# Altium project SR.PrjPcb (part 2 of 2)
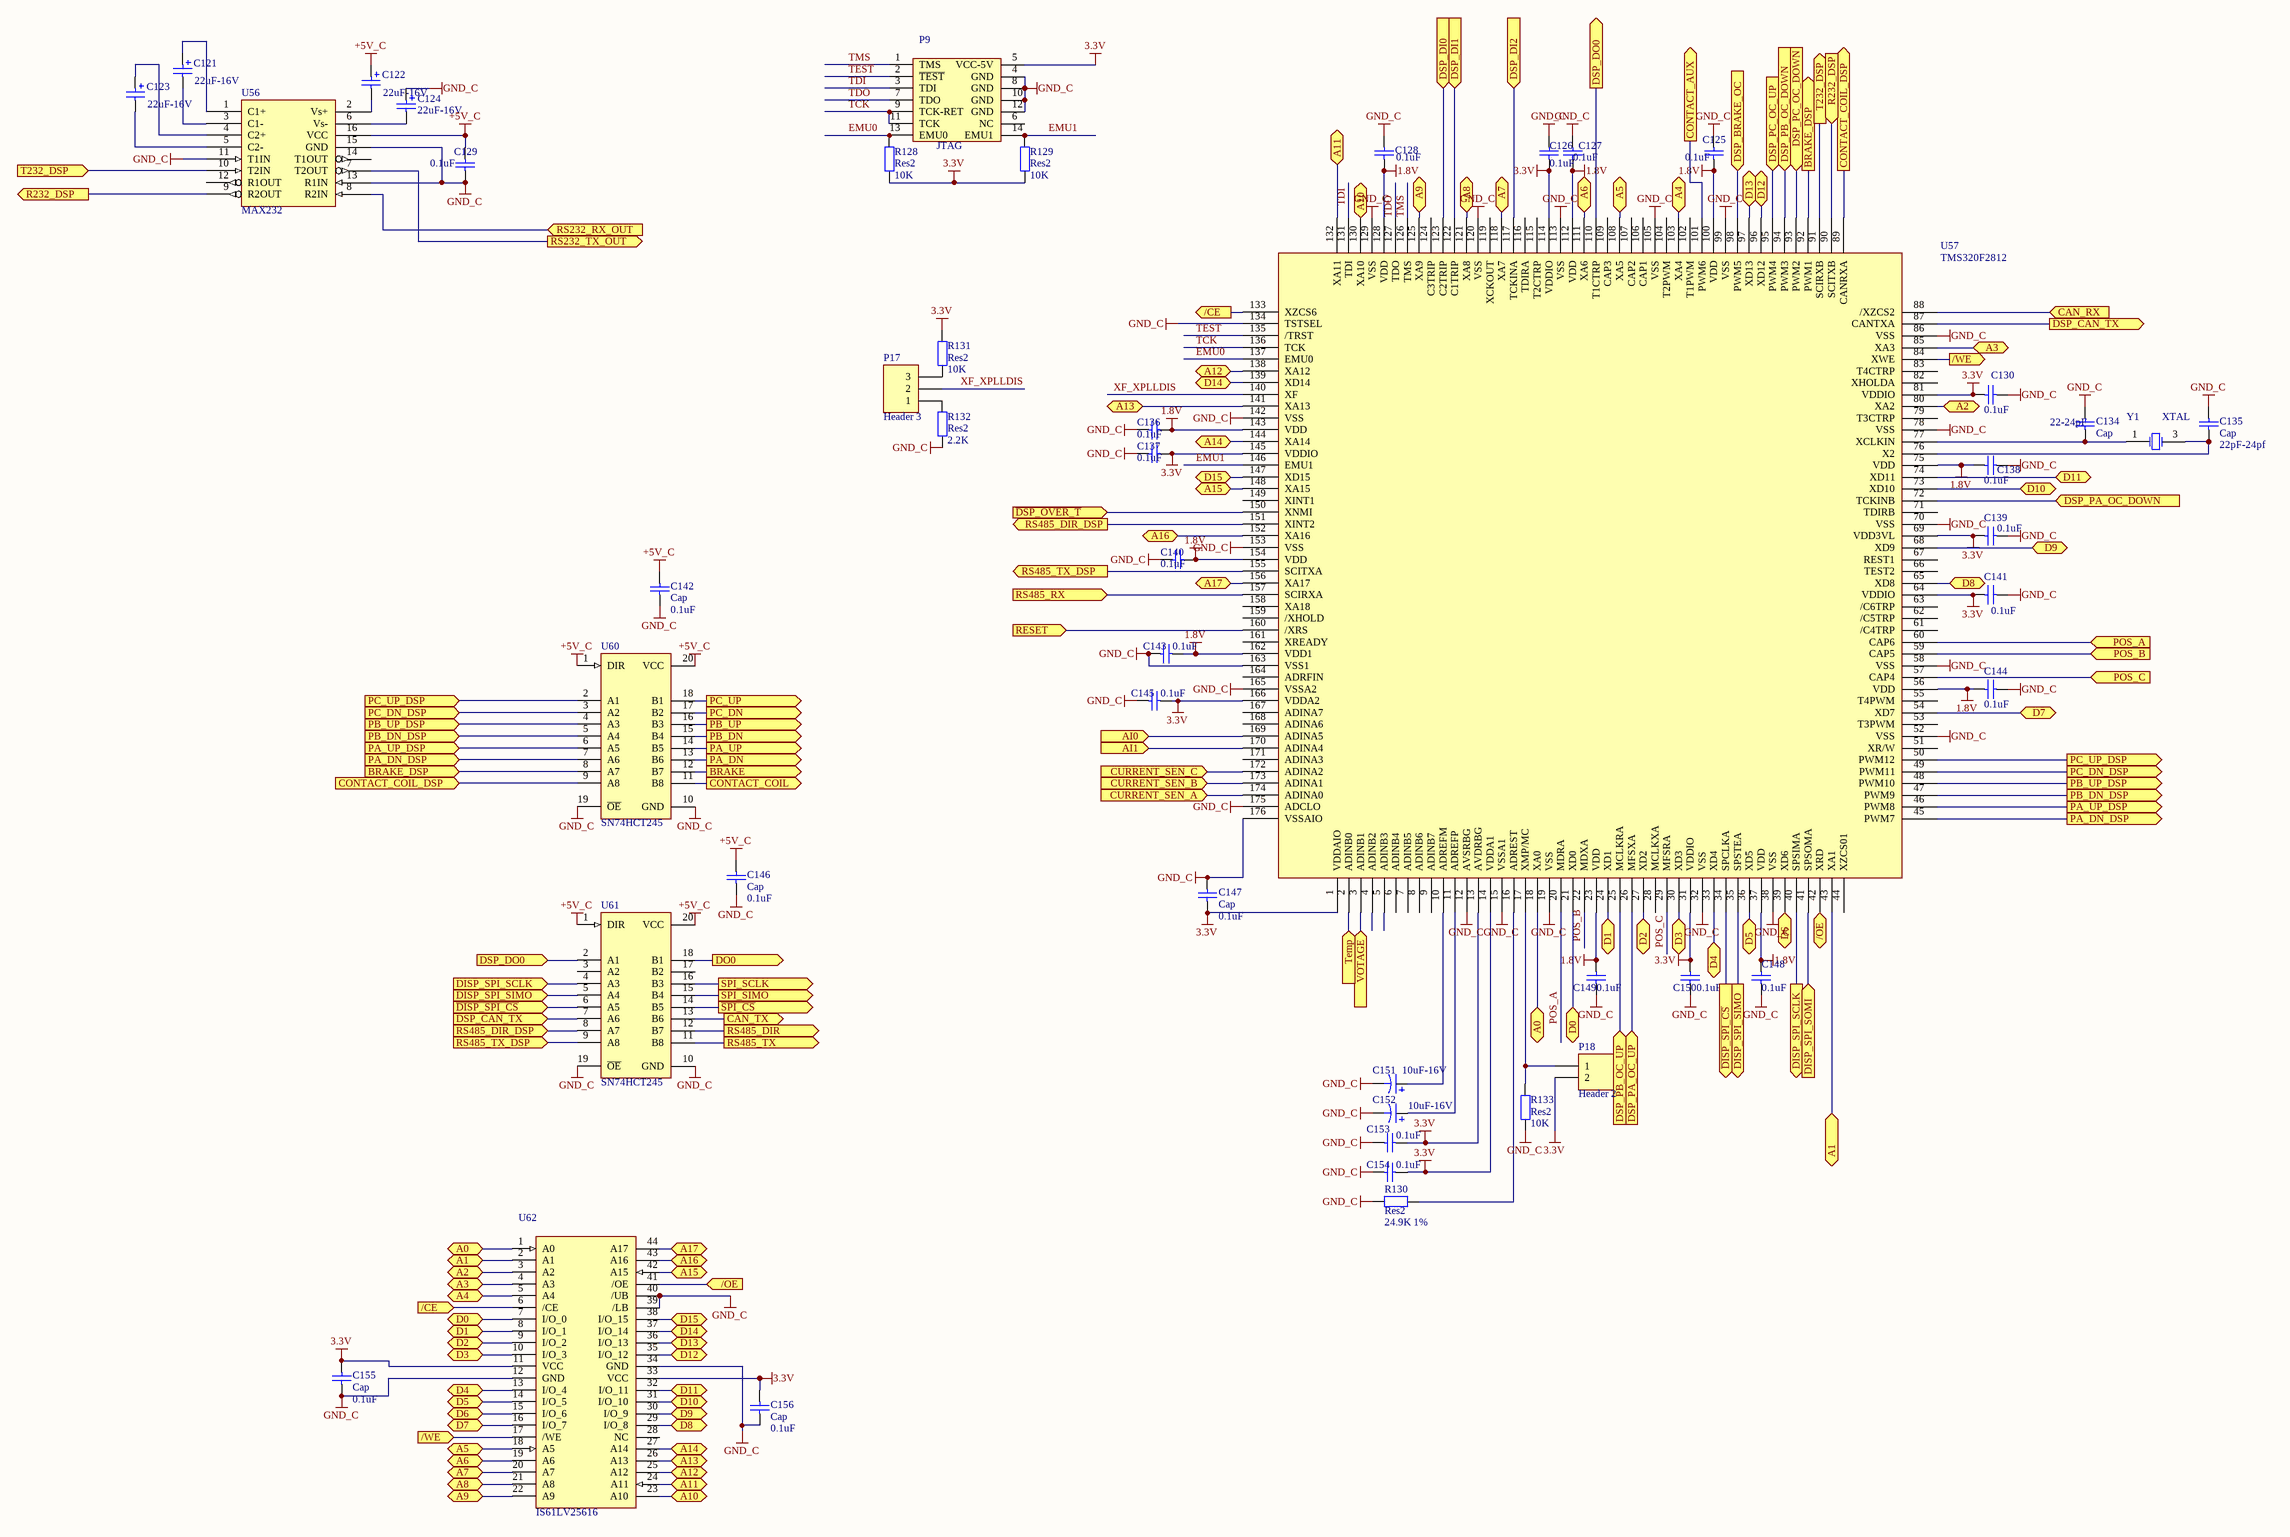
[diagram p6: dsp.SchDoc]

## Nets that join several sheets
1.8V: POWER (5 pins), dsp (20 pins)
3.3V: DRIVE (14 pins), AIAO (D36.2 D38.2 D40.2), DIDO (10 pins), PERIPHERAL (15 pins), POWER (7 pins), dsp (29 pins)
+5V_C: DRIVE (7 pins), PERIPHERAL (L4.1), POWER (16 pins), dsp (9 pins)
+5V_COM: PERIPHERAL (23 pins), POWER (C164.1 C165.2 L16.2 LED7.A)
+10V: AIAO (P1.1), POWER (C113.1 C115.2 L14.2)
+12V_P: DIDO (9 pins), POWER (C118.1 C120.2 L15.2 LED5.A)
+15V_A: AIAO (6 pins), POWER (8 pins)
+15V_C: AIAO (15 pins), POWER (C88.2 C90.1 L10.2 LED2.A)
+24V: DIDO (C60.1 C61.2 VT1.3), PERIPHERAL (L3.1 R93.2 R100.2 VT2.3), POWER (19 pins)
-15V_A: AIAO (C9.1 C21.1 U1.4 U2.4), POWER (C86.1 C87.2 L9.2 R136.1)
-15V_C: AIAO (15 pins), POWER (C92.1 C93.2 L11.2 R135.1)
DGND: DIDO (5 pins), PERIPHERAL (8 pins), POWER (19 pins)
GND_A: AIAO (21 pins), POWER (12 pins)
GND_C: DRIVE (10 pins), AIAO (31 pins), DIDO (12 pins), PERIPHERAL (13 pins), POWER (24 pins), dsp (70 pins)
GND_COM: PERIPHERAL (25 pins), POWER (C164.2 C165.1 DCDC5.3 R140.1)
GND_P: DIDO (9 pins), POWER (C118.2 C120.1 DCDC4.4 R138.1)
AI0: AIAO (C5.2 R1.2 U4.1), dsp (U57.169)
AI1: AIAO (C16.2 R11.2 U4.7), dsp (U57.170)
BRAKE: DRIVE (U30.3), dsp (U60.12)
CONTACT_AUX: PERIPHERAL (C71.2 R95.1), dsp (U57.101)
CURRENT_SEN_A: AIAO (D40.1 D41.2 U53.6 U53.7), dsp (U57.174)
CURRENT_SEN_B: AIAO (D38.1 D39.2 U8.6 U8.7), dsp (U57.173)
CURRENT_SEN_C: AIAO (D36.1 D37.2 U8.1 U8.2), dsp (U57.172)
~{DSP_OVER_T}: PERIPHERAL (C72.2 R103.1), dsp (U57.150)
DO0: DIDO (U21.2), dsp (U61.18)
NetC56_2: DIDO (C56.2 R56.2), dsp (U57.117)
NetC59_2: DIDO (C59.2 R59.2), dsp (U57.122)
NetC62_2: DIDO (C62.2 R64.2), dsp (U57.123)
NetR78_1: DRIVE (R78.1 U31.6), dsp (U57.98)
NetR81_1: DRIVE (R81.1 U32.6), dsp (U57.26)
NetR82_1: DRIVE (R82.1 U33.6), dsp (U57.72)
NetR85_1: DRIVE (R85.1 U34.6), dsp (U57.25)
NetR86_1: DRIVE (R86.1 U35.6), dsp (U57.94)
NetR89_1: DRIVE (R89.1 U36.6), dsp (U57.95)
NetR90_1: DRIVE (R90.1 U37.6), dsp (U57.93)
NetR104_1: PERIPHERAL (R104.1 U43.6), dsp (U57.41)
NetR106_1: PERIPHERAL (R106.1 U45.6), dsp (U57.88)
NetR118_1: PERIPHERAL (R118.1 U50.6), dsp (U57.157)
NetR124_1: POWER (R124.1 U54.15), dsp (U57.160)
NetU38_3: PERIPHERAL (U38.3), dsp (U61.16)
NetU41_3: PERIPHERAL (U41.3), dsp (U61.15)
NetU42_3: PERIPHERAL (U42.3), dsp (U61.14)
NetU46_2: PERIPHERAL (U46.2), dsp (U60.11)
NetU48_3: PERIPHERAL (U48.3), dsp (U61.13)
NetU49_3: PERIPHERAL (U49.3), dsp (U61.12)
NetU52_3: PERIPHERAL (U52.3), dsp (U61.11)
PA_DN: DRIVE (R73.1), dsp (U60.13)
PA_UP: DRIVE (U28.3), dsp (U60.14)
PB_DN: DRIVE (R72.1), dsp (U60.15)
PB_UP: DRIVE (U26.3), dsp (U60.16)
PC_DN: DRIVE (R70.1), dsp (U60.17)
PC_UP: DRIVE (U24.3), dsp (U60.18)
POS_A: DIDO (C49.2 R43.2), dsp (U57.20 U57.60)
POS_B: DIDO (C51.2 R46.2), dsp (U57.22 U57.59)
POS_C: DIDO (C54.2 R52.2), dsp (U57.29 U57.57)
RS232_RX_OUT: PERIPHERAL (P15.2 TVS4.1), dsp (U56.8)
RS232_TX_OUT: PERIPHERAL (P15.3 TVS5.1), dsp (U56.7)